# Altium schematic sheet CH585D-DG-R0.SchDoc
size 330 x 220 mm; SheetNumber: 1; SheetTotal: 1
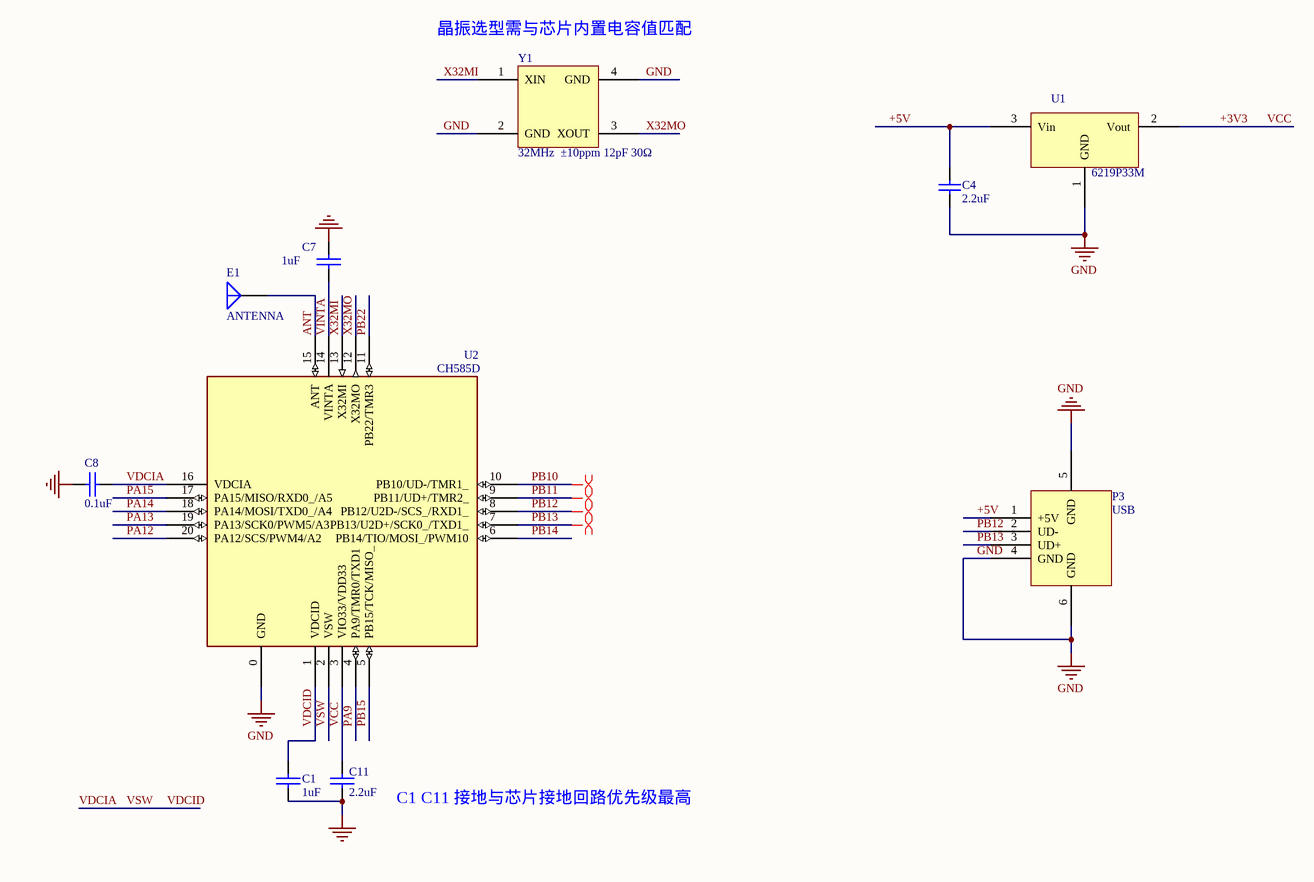
[diagram p0: CH585D-DG-R0.SchDoc]

## Parts
C1  1uF  [0402_C]
C4  2.2uF  [0402_C]
C7  1uF  [0402_C]
C8  0.1uF  [0402_C]
C11  2.2uF  [0402_C]
E1  ANTENNA  [ANT-F-1-2.4G-0.8mmFR4]
P3  USB  [USBAM-4P]
U1  6219P33M  [SOT-23]
U2  CH585D  [QFN20_3X3]
Y1  32MHz  ±10ppm 12pF 30Ω  [XT2016]

## Nets
GND: C1.1 C4.1 C7.2 C8.2 C11.1 P3.4(GND) P3.5(GND) P3.6(GND) U1.1(GND) U2.0(GND) Y1.2(GND) Y1.4(GND)
+3V3: C11.2 U1.2(Vout) U2.3(VIO33/VDD33)  [also labelled VCC]
+5V: C4.2 P3.1(+5V) U1.3(Vin)
ANT: E1.1(A) U2.15(ANT)
PA9: U2.4(PA9/TMR0/TXD1)
PA12: U2.20(PA12/SCS/PWM4/A2)
PA13: U2.19(PA13/SCK0/PWM5/A3)
PA14: U2.18(PA14/MOSI/TXD0_/A4)
PA15: U2.17(PA15/MISO/RXD0_/A5)
PB10: U2.10(PB10/UD-/TMR1_)
PB11: U2.9(PB11/UD+/TMR2_)
PB12: P3.2(UD-) U2.8(PB12/U2D-/SCS_/RXD1_)
PB13: P3.3(UD+) U2.7(PB13/U2D+/SCK0_/TXD1_)
PB14: U2.6(PB14/TIO/MOSI_/PWM10)
PB15: U2.5(PB15/TCK/MISO_)
PB22: U2.11(PB22/TMR3)
VDCIA: C1.2 C8.1 U2.1(VDCID) U2.2(VSW) U2.16(VDCIA)  [also labelled VDCID, VSW]
VINTA: C7.1 U2.14(VINTA)
X32MI: U2.13(X32MI) Y1.1(XIN)
X32MO: U2.12(X32MO) Y1.3(XOUT)

## Layout directives
differential pair: PB10, PB11, PB12, PB13

## Notes on the sheet
- (near Y1) 晶振选型需与芯片内置电容值匹配
- C1 C11 接地与芯片接地回路优先级最高

## Library data of the parts
C1 C7 C8 C11 = CAP: Capacitor
C4 = Cap: Capacitor; Value: 100pF; Published: 8-Jun-2000; LatestRevisionDate: 17-Jul-2002; LatestRevisionNote: Re-released for DXP Platform.; PackageReference: RAD-0.3; Publisher: Altium Limited
E1 = ANTENNA: Generic Antenna
U2 = CH585D: RISC-V MCU with BLE/HSUSB/USB/ADC/PWM/SPI/2*UART
Y1 = 晶体